# Altium schematic sheet Arduino FPGA Top-Level Interface.SchDoc
size A3
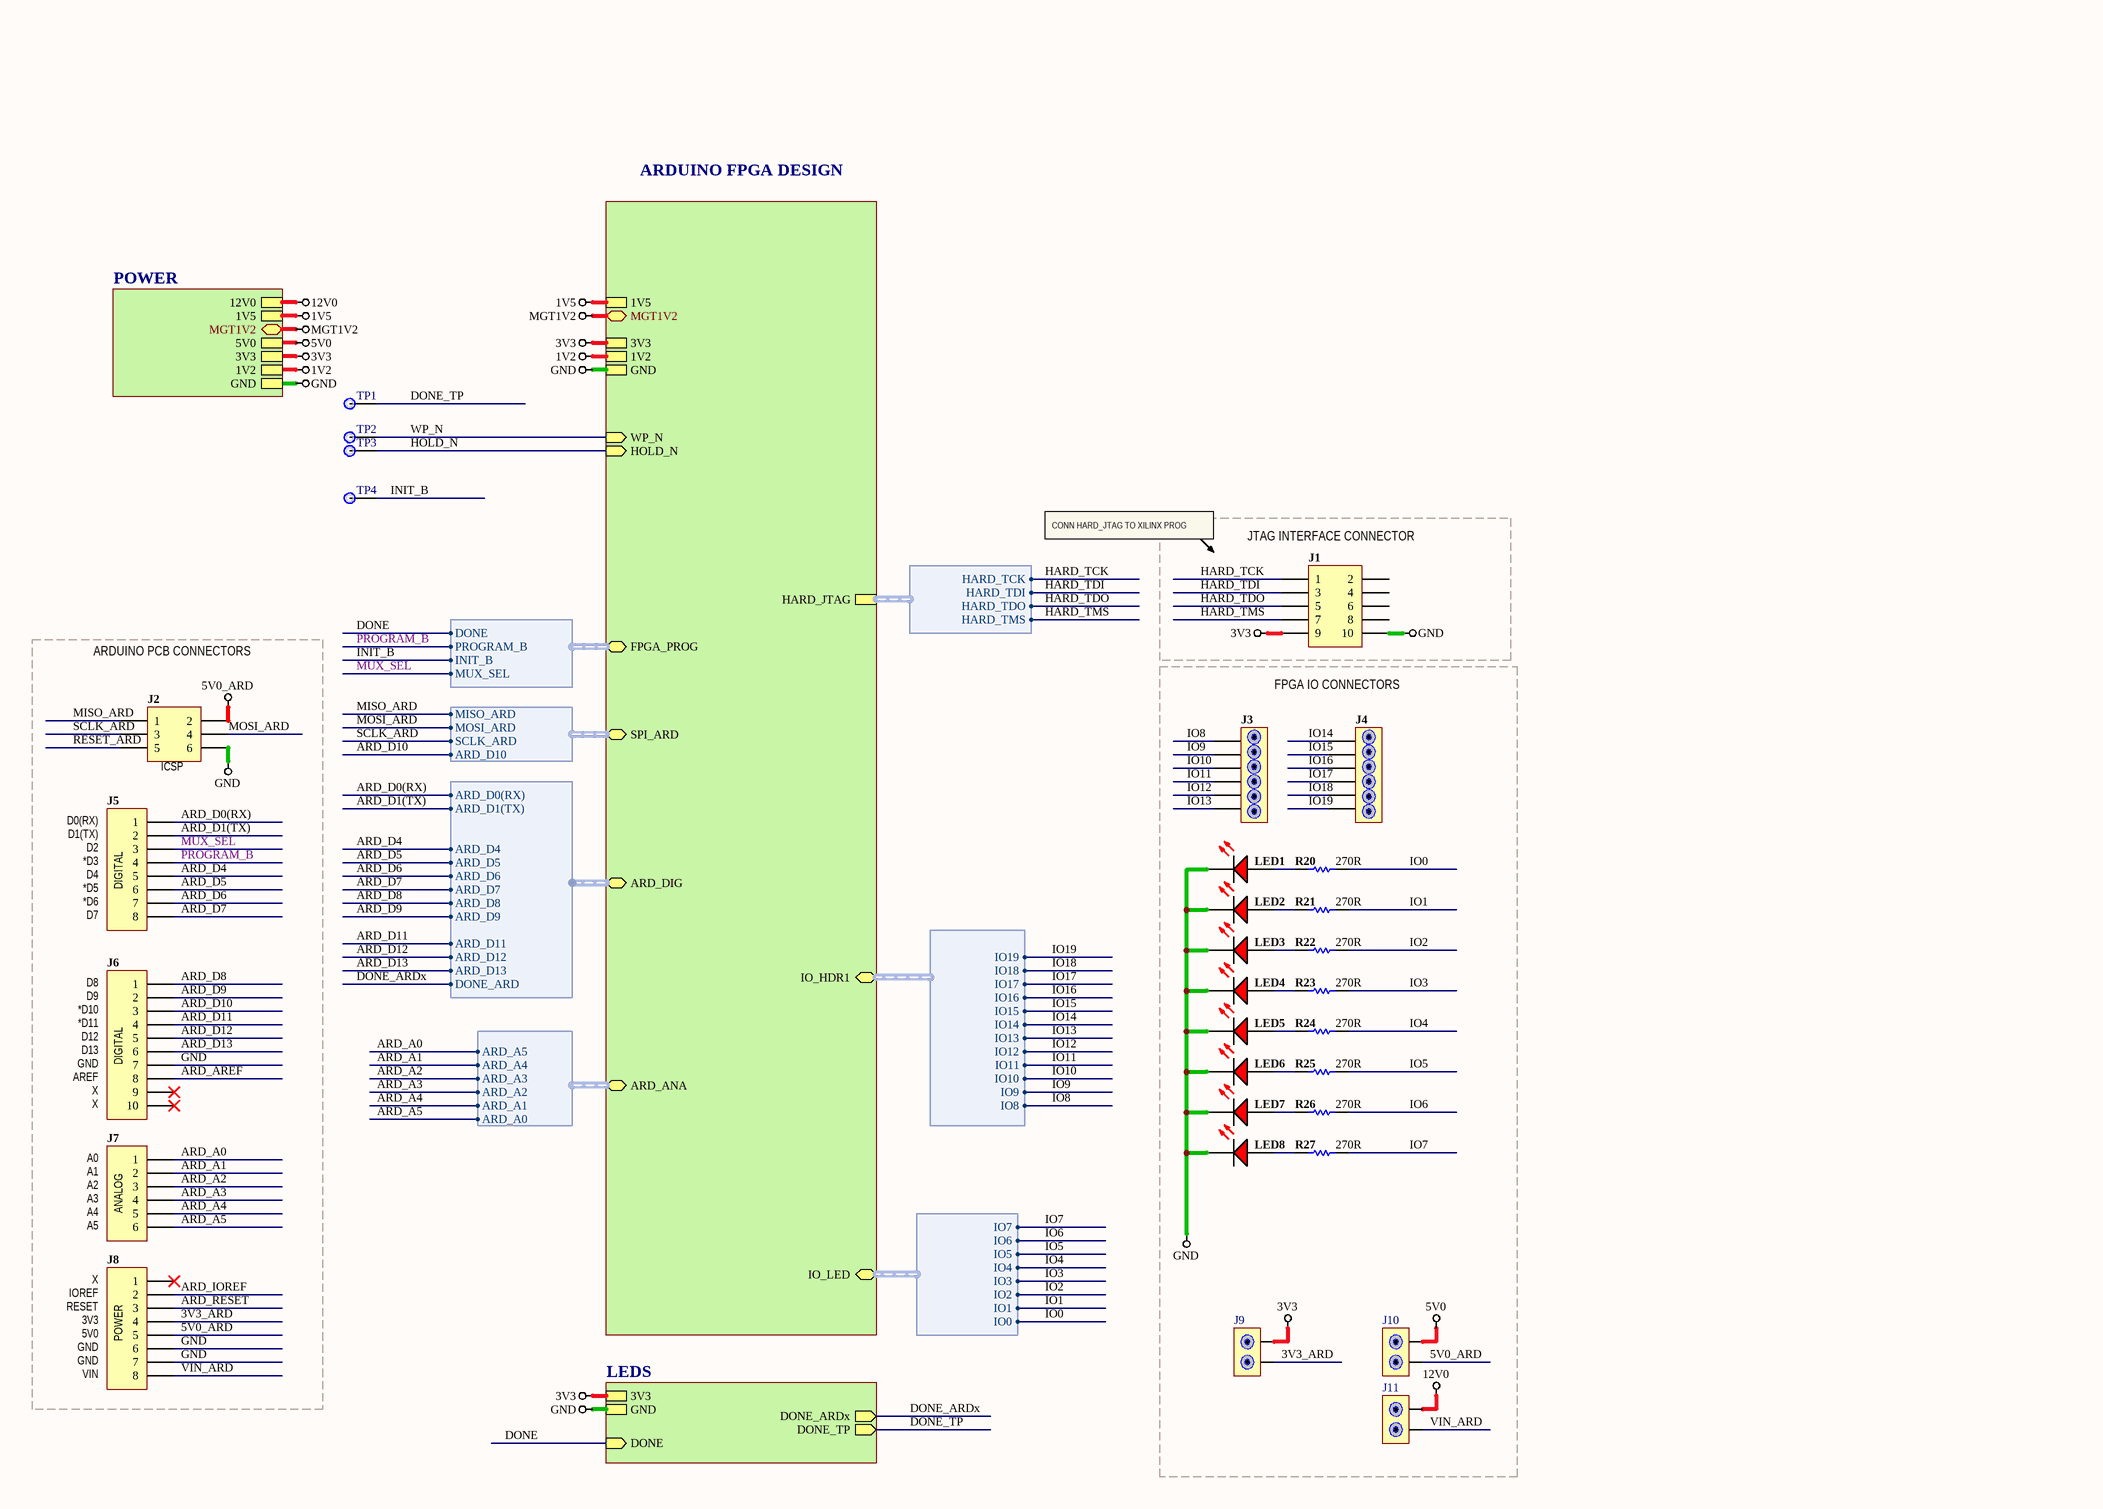
[diagram p0: Arduino FPGA Top-Level Interface.SchDoc]

## Parts
J1  Header 5X2  [HDR2X5]  (value not drawn)
J2  Header 3X2  [2X03]  (value not drawn)
J3  6-POS VERTICAL HEADER  [HDR1X6]  (value not drawn)
J4  6-POS VERTICAL HEADER  [HDR1X6]  (value not drawn)
J5  Header 8  [1X08]  (value not drawn)
J6  Header 10  [1X10@1]  (value not drawn)
J7  Header 6  [1X06]  (value not drawn)
J8  Header 8  [1X08]  (value not drawn)
J9  Jumper  [JMP1X2]  (value not drawn)
J10  Jumper  [JMP1X2]  (value not drawn)
J11  Jumper  [JMP1X2]  (value not drawn)
LED1  0402-LED-RED  [LED_0402]  (value not drawn)
LED2  0402-LED-RED  [LED_0402]  (value not drawn)
LED3  0402-LED-RED  [LED_0402]  (value not drawn)
LED4  0402-LED-RED  [LED_0402]  (value not drawn)
LED5  0402-LED-RED  [LED_0402]  (value not drawn)
LED6  0402-LED-RED  [LED_0402]  (value not drawn)
LED7  0402-LED-RED  [LED_0402]  (value not drawn)
LED8  0402-LED-RED  [LED_0402]  (value not drawn)
R20  value 270R  [RESC0402(1005)40_L]  (hidden comment: 270R 1 0402)
R21  value 270R  [RESC0402(1005)40_L]  (hidden comment: 270R 1 0402)
R22  value 270R  [RESC0402(1005)40_L]  (hidden comment: 270R 1 0402)
R23  value 270R  [RESC0402(1005)40_L]  (hidden comment: 270R 1 0402)
R24  value 270R  [RESC0402(1005)40_L]  (hidden comment: 270R 1 0402)
R25  value 270R  [RESC0402(1005)40_L]  (hidden comment: 270R 1 0402)
R26  value 270R  [RESC0402(1005)40_L]  (hidden comment: 270R 1 0402)
R27  value 270R  [RESC0402(1005)40_L]  (hidden comment: 270R 1 0402)
TP1  TESTPOINT_TH  [TESTPOINT_TH]  (value not drawn)
TP2  TESTPOINT_TH  [TESTPOINT_TH]  (value not drawn)
TP3  TESTPOINT_TH  [TESTPOINT_TH]  (value not drawn)
TP4  TESTPOINT_TH  [TESTPOINT_TH]  (value not drawn)

## Blocks framed on the sheet
JTAG INTERFACE CONNECTOR: J1
ARDUINO PCB CONNECTORS: J2 J5-J8
FPGA IO CONNECTORS: J3 J4 J9-J11 LED1-LED8 R20-R27

## Sub-sheets
ARDUINO FPGA DESIGN = Arduino FPGA Design.SchDoc: 3V3, GND, 1V2, HARD_JTAG (harness HARD_JTAG), WP_N (in), HOLD_N (in), FPGA_PROG (harness FPGA_PROGRAM), SPI_ARD (harness SPI_ARD), ARD_DIG (harness ARD_DIG), MGT1V2, 1V5, ARD_ANA (harness ARD_ANA), IO_HDR1 (harness IO_HDR1), IO_LED (harness IO_LED)
LEDS = LEDS - Status.SchDoc: GND, DONE (in), DONE_ARDx (out), DONE_TP (out), 3V3
POWER = Power.SchDoc: 5V0, 3V3, 1V2, GND, 1V5, MGT1V2, 12V0

## Harnesses
HARD_JTAG: HARD_TCK, HARD_TDI, HARD_TDO, HARD_TMS
FPGA_PROGRAM: INIT_B, PROGRAM_B, DONE, MUX_SEL
SPI_ARD: MISO_ARD, MOSI_ARD, SCLK_ARD, ARD_D10
ARD_DIG: ARD_D0(RX), ARD_D1(TX), ARD_D4, ARD_D5, ARD_D6, ARD_D7, ARD_D8, ARD_D9, ARD_D11, ARD_D12, ARD_D13, DONE_ARD
ARD_ANA: ARD_A0, ARD_A1, ARD_A2, ARD_A3, ARD_A4, ARD_A5
IO_LED: IO0, IO1, IO2, IO3, IO4, IO5, IO6, IO7
IO_HDR1: IO12, IO13, IO16, IO17, IO18, IO19, IO14, IO15, IO8, IO9, IO10, IO11

## Nets
1V2: sheet ARDUINO FPGA DESIGN/1V2, sheet POWER/1V2
1V5: sheet ARDUINO FPGA DESIGN/1V5, sheet POWER/1V5
3V3: J1.9 J9.2 ; sheet ARDUINO FPGA DESIGN/3V3, sheet POWER/3V3, sheet LEDS/3V3
5V0: J10.2 ; sheet POWER/5V0
5V0_ARD: J8.5 J10.1
12V0: J11.2 ; sheet POWER/12V0
GND: J1.10 J2.6 J6.7 J8.6 J8.7 LED1.2(K) LED2.2(K) LED3.2(K) LED4.2(K) LED5.2(K) LED6.2(K) LED7.2(K) LED8.2(K) ; sheet ARDUINO FPGA DESIGN/GND, sheet POWER/GND, sheet LEDS/GND
MGT1V2: sheet ARDUINO FPGA DESIGN/MGT1V2, sheet POWER/MGT1V2
3V3_ARD: J8.4 J9.1
ARD_A0: J7.1 ; sheet ARDUINO FPGA DESIGN/ARD_ANA.ARD_A5
ARD_A1: J7.2 ; sheet ARDUINO FPGA DESIGN/ARD_ANA.ARD_A4
ARD_A2: J7.3 ; sheet ARDUINO FPGA DESIGN/ARD_ANA.ARD_A3
ARD_A3: J7.4 ; sheet ARDUINO FPGA DESIGN/ARD_ANA.ARD_A2
ARD_A4: J7.5 ; sheet ARDUINO FPGA DESIGN/ARD_ANA.ARD_A1
ARD_A5: J7.6 ; sheet ARDUINO FPGA DESIGN/ARD_ANA.ARD_A0
ARD_AREF: J6.8
ARD_D0(RX): J5.1 ; sheet ARDUINO FPGA DESIGN/ARD_DIG.ARD_D0(RX)
ARD_D1(TX): J5.2 ; sheet ARDUINO FPGA DESIGN/ARD_DIG.ARD_D1(TX)
ARD_D4: J5.5 ; sheet ARDUINO FPGA DESIGN/ARD_DIG.ARD_D4
ARD_D5: J5.6 ; sheet ARDUINO FPGA DESIGN/ARD_DIG.ARD_D5
ARD_D6: J5.7 ; sheet ARDUINO FPGA DESIGN/ARD_DIG.ARD_D6
ARD_D7: J5.8 ; sheet ARDUINO FPGA DESIGN/ARD_DIG.ARD_D7
ARD_D8: J6.1 ; sheet ARDUINO FPGA DESIGN/ARD_DIG.ARD_D8
ARD_D9: J6.2 ; sheet ARDUINO FPGA DESIGN/ARD_DIG.ARD_D9
ARD_D10: J6.3 ; sheet ARDUINO FPGA DESIGN/SPI_ARD.ARD_D10
ARD_D11: J6.4 ; sheet ARDUINO FPGA DESIGN/ARD_DIG.ARD_D11
ARD_D12: J6.5 ; sheet ARDUINO FPGA DESIGN/ARD_DIG.ARD_D12
ARD_D13: J6.6 ; sheet ARDUINO FPGA DESIGN/ARD_DIG.ARD_D13
ARD_IOREF: J8.2
ARD_RESET: J8.3
DONE: sheet LEDS/DONE, sheet ARDUINO FPGA DESIGN/FPGA_PROG.DONE
DONE_ARDx: sheet LEDS/DONE_ARDx, sheet ARDUINO FPGA DESIGN/ARD_DIG.DONE_ARD
DONE_TP: TP1.1 ; sheet LEDS/DONE_TP
HARD_TCK: J1.1 ; sheet ARDUINO FPGA DESIGN/HARD_JTAG.HARD_TCK
HARD_TDI: J1.3 ; sheet ARDUINO FPGA DESIGN/HARD_JTAG.HARD_TDI
HARD_TDO: J1.5 ; sheet ARDUINO FPGA DESIGN/HARD_JTAG.HARD_TDO
HARD_TMS: J1.7 ; sheet ARDUINO FPGA DESIGN/HARD_JTAG.HARD_TMS
HOLD_N: TP3.1 ; sheet ARDUINO FPGA DESIGN/HOLD_N
INIT_B: TP4.1 ; sheet ARDUINO FPGA DESIGN/FPGA_PROG.INIT_B
IO0: R20.2 ; sheet ARDUINO FPGA DESIGN/IO_LED.IO0
IO1: R21.2 ; sheet ARDUINO FPGA DESIGN/IO_LED.IO1
IO2: R22.2 ; sheet ARDUINO FPGA DESIGN/IO_LED.IO2
IO3: R23.2 ; sheet ARDUINO FPGA DESIGN/IO_LED.IO3
IO4: R24.2 ; sheet ARDUINO FPGA DESIGN/IO_LED.IO4
IO5: R25.2 ; sheet ARDUINO FPGA DESIGN/IO_LED.IO5
IO6: R26.2 ; sheet ARDUINO FPGA DESIGN/IO_LED.IO6
IO7: R27.2 ; sheet ARDUINO FPGA DESIGN/IO_LED.IO7
IO8: J3.1 ; sheet ARDUINO FPGA DESIGN/IO_HDR1.IO8
IO9: J3.2 ; sheet ARDUINO FPGA DESIGN/IO_HDR1.IO9
IO10: J3.3 ; sheet ARDUINO FPGA DESIGN/IO_HDR1.IO10
IO11: J3.4 ; sheet ARDUINO FPGA DESIGN/IO_HDR1.IO11
IO12: J3.5 ; sheet ARDUINO FPGA DESIGN/IO_HDR1.IO12
IO13: J3.6 ; sheet ARDUINO FPGA DESIGN/IO_HDR1.IO13
IO14: J4.1 ; sheet ARDUINO FPGA DESIGN/IO_HDR1.IO14
IO15: J4.2 ; sheet ARDUINO FPGA DESIGN/IO_HDR1.IO15
IO16: J4.3 ; sheet ARDUINO FPGA DESIGN/IO_HDR1.IO16
IO17: J4.4 ; sheet ARDUINO FPGA DESIGN/IO_HDR1.IO17
IO18: J4.5 ; sheet ARDUINO FPGA DESIGN/IO_HDR1.IO18
IO19: J4.6 ; sheet ARDUINO FPGA DESIGN/IO_HDR1.IO19
MISO_ARD: J2.1 ; sheet ARDUINO FPGA DESIGN/SPI_ARD.MISO_ARD
MOSI_ARD: J2.4 ; sheet ARDUINO FPGA DESIGN/SPI_ARD.MOSI_ARD
MUX_SEL: J5.3 ; sheet ARDUINO FPGA DESIGN/FPGA_PROG.MUX_SEL
PROGRAM_B: J5.4 ; sheet ARDUINO FPGA DESIGN/FPGA_PROG.PROGRAM_B
RESET_ARD: J2.5
SCLK_ARD: J2.3 ; sheet ARDUINO FPGA DESIGN/SPI_ARD.SCLK_ARD
VIN_ARD: J8.8 J11.1
WP_N: TP2.1 ; sheet ARDUINO FPGA DESIGN/WP_N
NetLED1_1: LED1.1(A) R20.1
NetLED2_1: LED2.1(A) R21.1
NetLED3_1: LED3.1(A) R22.1
NetLED4_1: LED4.1(A) R23.1
NetLED5_1: LED5.1(A) R24.1
NetLED6_1: LED6.1(A) R25.1
NetLED7_1: LED7.1(A) R26.1
NetLED8_1: LED8.1(A) R27.1

Not connected (* = marked no-connect by the designer): J1 2 4 6 8; J2 2; J6 9* 10*; J8 1*

## Notes on the sheet
- CONN HARD_JTAG TO XILINX PROG
- (near J2) ICSP
- (near J5) D0(RX)
- (near J5) D1(TX)
- (near J5) D2
- (near J5) *D3
- (near J5) D4
- (near J5) *D5
- (near J5) *D6
- (near J5) D7
- (near J5) DIGITAL
- (near J6) D8
- (near J6) D9
- (near J6) *D10
- (near J6) *D11
- (near J6) D12
- (near J6) D13
- (near J6) GND
- (near J6) AREF
- (near J6) X
- X
- (near J6) DIGITAL
- A0
- (near J7) A1
- (near J7) A2
- (near J7) A3
- (near J7) A4
- A5
- (near J7) ANALOG
- (near J8) IOREF
- (near J8) RESET
- (near J8) 3V3
- (near J8) 5V0
- (near J8) GND
- (near J8) VIN
- (near J8) POWER
- Labels drawn without touching a wire or pin: 5V0_ARD

## Library data of the parts
J1 = Header 5X2: Header, 5-Pin, Dual row; Manufacturer_PN: 67997-210HLF; LatestRevisionDate: 17-Jul-2002; LatestRevisionNote: Re-released for DXP Platform.; Publisher: Altium Limited; Manufacturer Part Number: 67997-210HLF
J2 = Header 3X2: Header, 3-Pin, Dual row; Manufacturer_PN: DNP; LatestRevisionDate: 17-Jul-2002; LatestRevisionNote: Re-released for DXP Platform.; Publisher: Altium Limited; Manufacturer Part Number: DNP
J3 J4 = 6-POS-HDR: Manufacturer_PN: 68000-406HLF; Manufacturer Part Number: 68000-406HLF
J5 J8 = Header 8: Header, 8-Pin; Manufacturer_PN: DNP; LatestRevisionDate: 17-Jul-2002; LatestRevisionNote: Re-released for DXP Platform.; Publisher: Altium Limited; Manufacturer Part Number: DNP
J6 = Header 10: Header, 10-Pin; Manufacturer_PN: DNP; LatestRevisionDate: 17-Jul-2002; LatestRevisionNote: Re-released for DXP Platform.; Publisher: Altium Limited; Manufacturer Part Number: DNP
J7 = Header 6: Header, 6-Pin; Manufacturer_PN: DNP; LatestRevisionDate: 17-Jul-2002; LatestRevisionNote: Re-released for DXP Platform.; Publisher: Altium Limited; Manufacturer Part Number: DNP
J9-J11 = JMP1X2: Standard 2 Pin Jumper, 100mil spacing; Manufacturer_PN: M20-9770246; Manufacturer Part Number: M20-9770246
LED1-LED8 = CMP-0201-0013: 0402 LED,RED; Manufacturer_PN: LTST-C190KRKT; DefaultDesignator: LED?; Class: Diodes; Current Average (Io): 1.8V; ID: CMP-0201-0013; Sub Class: LED; Reverse Voltage DC (Vr): Red; ComponentLink1Description: Datasheet; ComponentLink1URL: http://optoelectronics.liteon.com/upload/download/DS-22-99-0151/S_110_LTST-C190KRKT.pdf; ComponentLink2Description: Manufacturer; ComponentLink2URL: http://www.liteon.com; Manufacturer Part Number: LTST-C190KRKT
R20-R27 = CMP-0503-0059: 0402 (1005 Metric) 1/16 W 270R 1 Thick Film Chip Resistor; Manufacturer_PN: RC1005F271CS; Case-EIA: 0402; Case-Metric: 1005; Temp Coefficient ppm/°C: ±100; Tolerance %: 1%; Value (Ohms): 270; Power: 1/16 W; ID: CMP-0503-0059; Technology: SMT; Manufacturer Part Number: RC1005F271CS
TP1-TP4 = TESTPOINT_TH: Manufacturer_PN: TESTPOINT; Manufacturer Part Number: TESTPOINT